# EasyEDA schematic lora_external_dev_board.json
TITLE: Sheet_1; REV: 1.0; Date: 2025-01-18; Sheet: 1/1; Drawn By: ruchika.3pvisionx; Company: Your Company
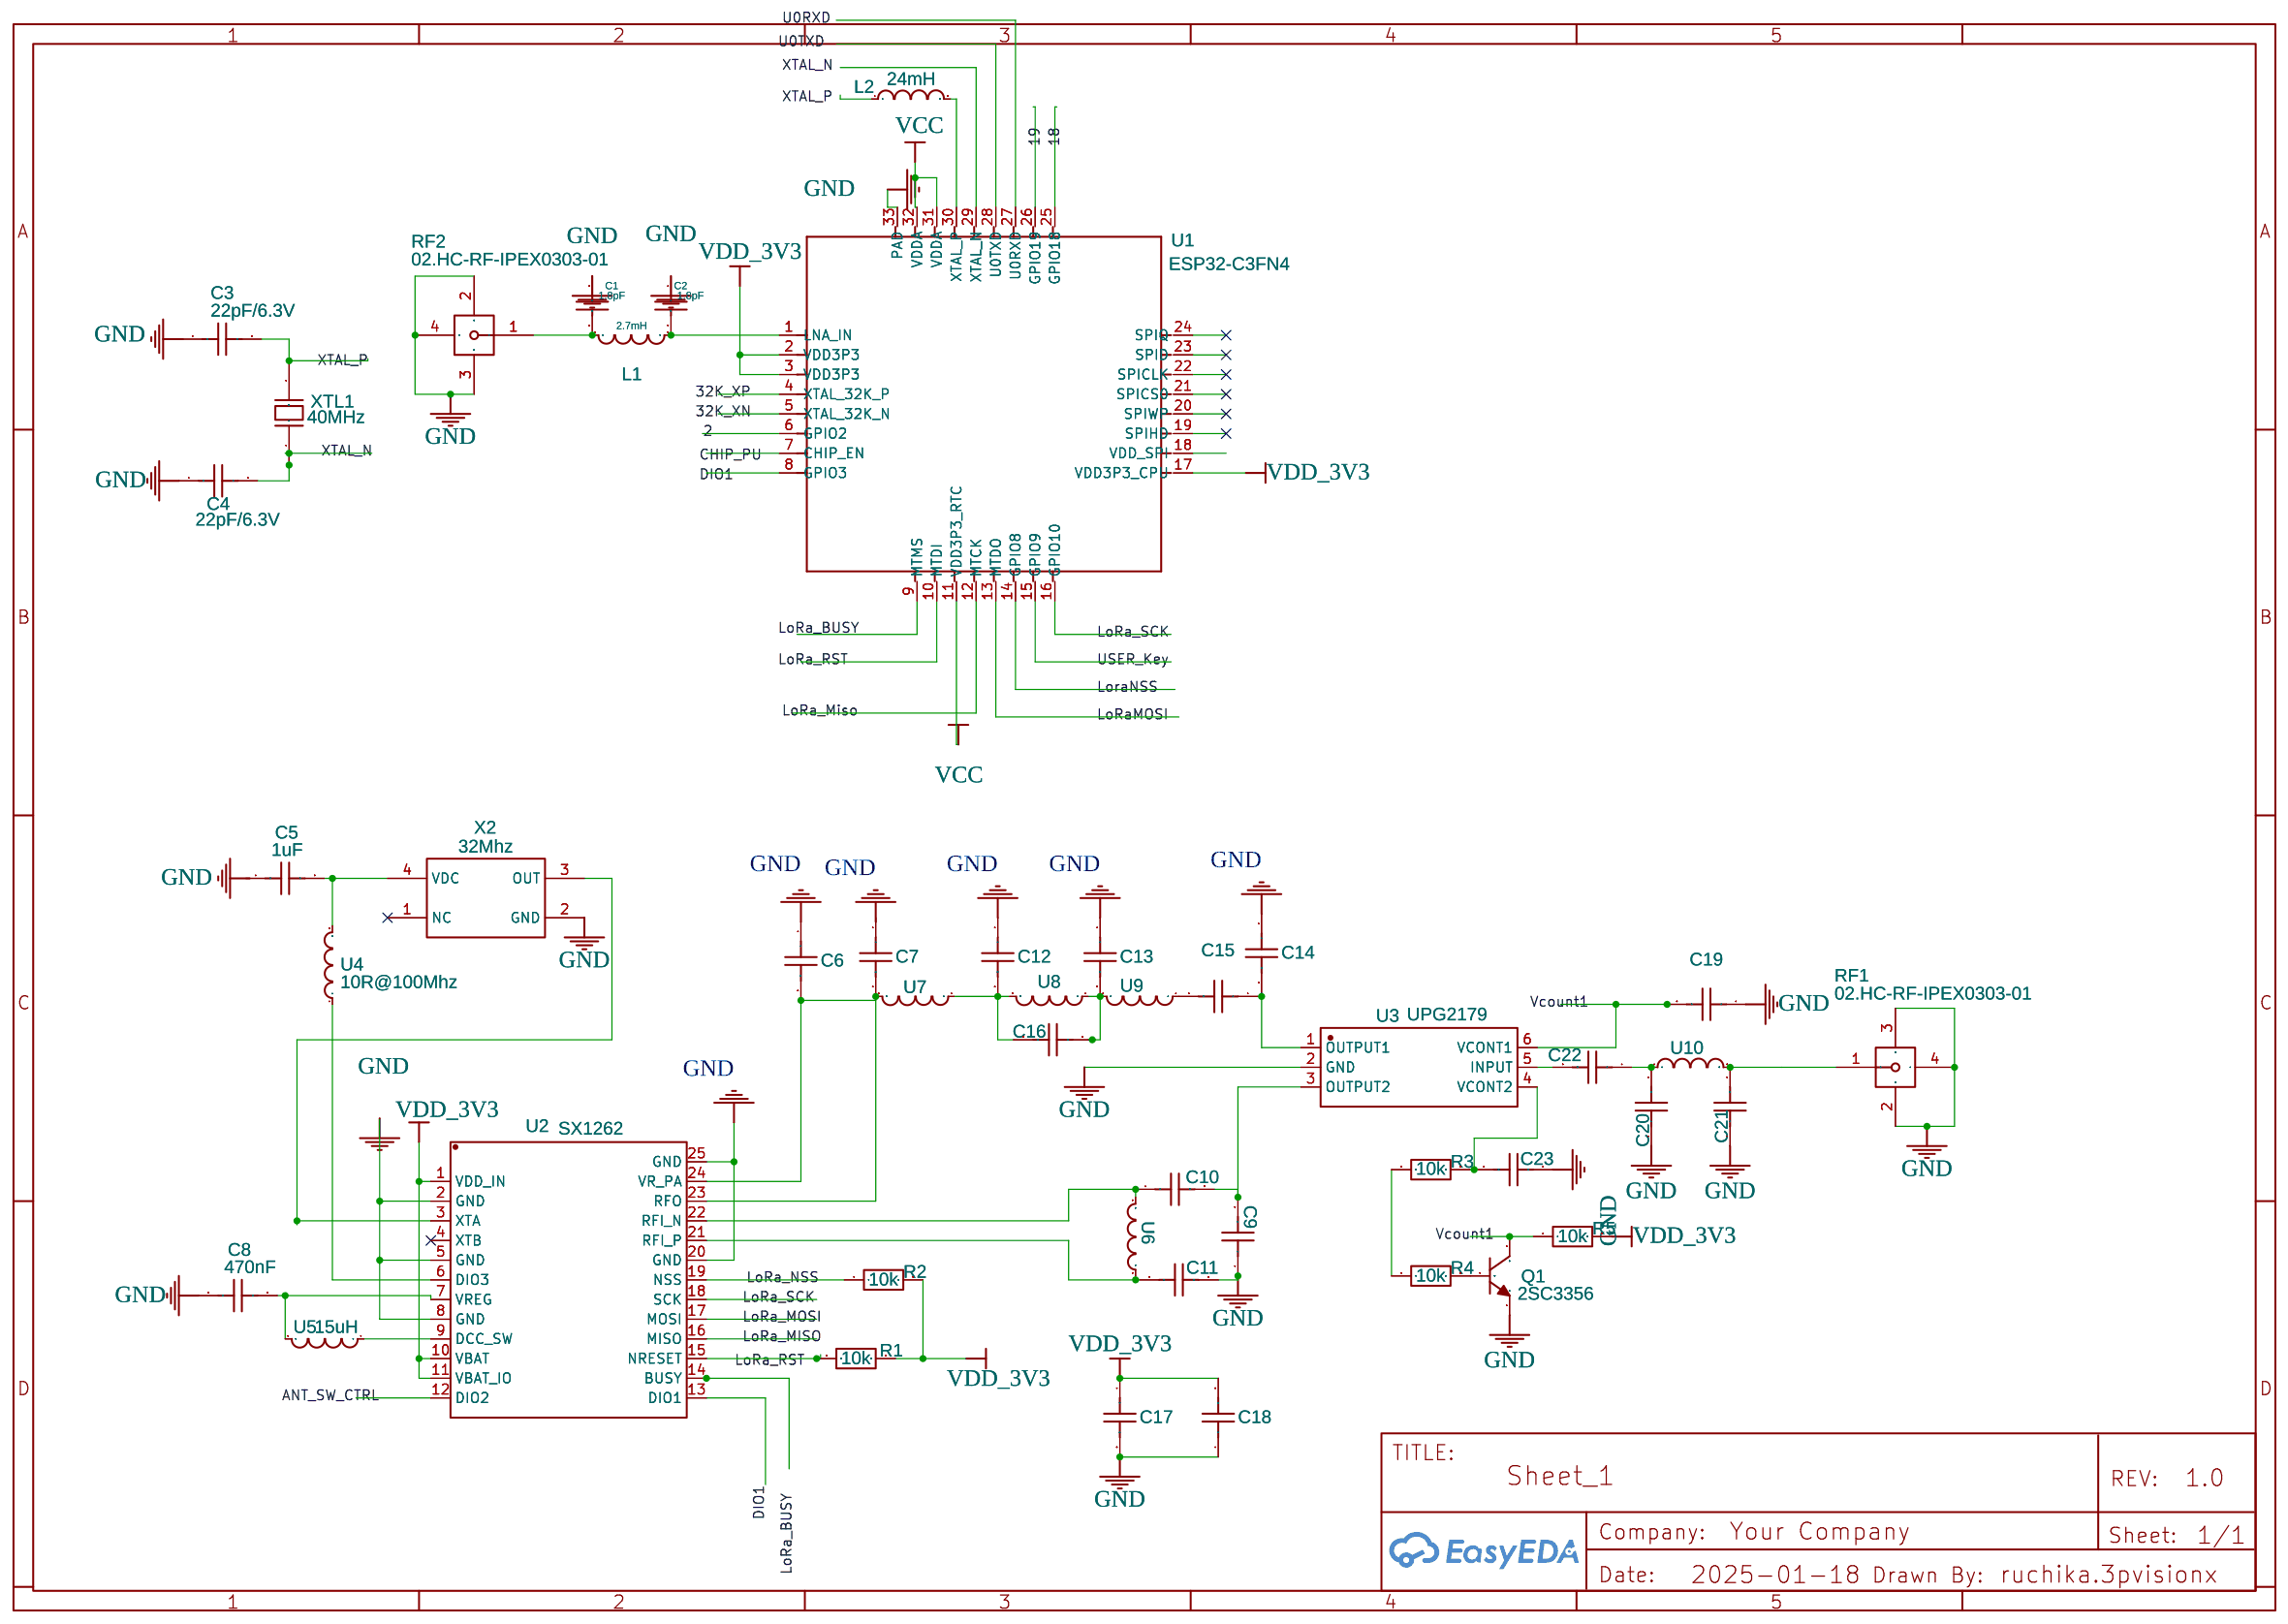
[diagram p0: schematic sheet]

## Parts
C1  1.8pF  [C0402]
C2  1.8pF  [C0402]
C3  22pF/6.3V  [C0402]
C4  22pF/6.3V  [C0402]
C5  1uF  [CAP-TH_L17.0-W8.5-P15.00-D1.2-FD]
C6  1uF  [CAP-TH_L17.0-W8.5-P15.00-D1.2-FD]
C7  1uF  [CAP-TH_L17.0-W8.5-P15.00-D1.2-FD]
C8  470nF  [CAP-TH_L17.0-W8.5-P15.00-D1.2-FD]
C9  1uF  [CAP-TH_L17.0-W8.5-P15.00-D1.2-FD]
C10  1uF  [CAP-TH_L17.0-W8.5-P15.00-D1.2-FD]
C11  1uF  [CAP-TH_L17.0-W8.5-P15.00-D1.2-FD]
C12  1uF  [CAP-TH_L17.0-W8.5-P15.00-D1.2-FD]
C13  1uF  [CAP-TH_L17.0-W8.5-P15.00-D1.2-FD]
C14  1uF  [CAP-TH_L17.0-W8.5-P15.00-D1.2-FD]
C15  1uF  [CAP-TH_L17.0-W8.5-P15.00-D1.2-FD]
C16  1uF  [CAP-TH_L17.0-W8.5-P15.00-D1.2-FD]
C17  1uF  [CAP-TH_L17.0-W8.5-P15.00-D1.2-FD]
C18  1uF  [CAP-TH_L17.0-W8.5-P15.00-D1.2-FD]
C19  1uF  [CAP-TH_L17.0-W8.5-P15.00-D1.2-FD]
C20  1uF  [CAP-TH_L17.0-W8.5-P15.00-D1.2-FD]
C21  1uF  [CAP-TH_L17.0-W8.5-P15.00-D1.2-FD]
C22  1uF  [CAP-TH_L17.0-W8.5-P15.00-D1.2-FD]
C23  1uF  [CAP-TH_L17.0-W8.5-P15.00-D1.2-FD]
L1  2.7mH  [2.7MH SB3M]
L2  24mH  [INDUCTOR]
Q1  2SC3356  [SOT-23-3_L2.9-W1.3-P1.90-LS2.4-BR-2]
R1  10k  [R0603]
R2  10k  [R0603]
R3  10k  [R0603]
R4  10k  [R0603]
R5  10k  [R0603]
RF1  02.HC-RF-IPEX0303-01  [IPEX-SMD_HC-RF-IPEX0303-01]
RF2  02.HC-RF-IPEX0303-01  [IPEX-SMD_HC-RF-IPEX0303-01]
U1  ESP32-C3FN4  [QFN32G-0.5-5X5MM]
U2  SX1262  [QFN-24_L4.0-W4.0-P0.50-BL-EP2.6]
U3  UPG2179  [SOT-363_L2.0-W1.3-P0.65-LS2.1-BL]
U4  10R@100Mhz  [IND-SMD_L1.6-W1.0]
U5  15uH  [IND-SMD_L1.6-W1.0]
U6  15uH  [IND-SMD_L1.6-W1.0]
U7  15uH  [IND-SMD_L1.6-W1.0]
U8  15uH  [IND-SMD_L1.6-W1.0]
U9  15uH  [IND-SMD_L1.6-W1.0]
U10  15uH  [IND-SMD_L1.6-W1.0]
X2  32Mhz  [40MHZ CRYSTAL OSCILLATOR]
XTL1  40MHz  [16MHZ CRYSTAL]

## Library data of the parts
C1 = GJM1555C1H1R8BB01D: Supplier: LCSC; Manufacturer: muRata(村田); Supplier Part: C76902; JLCPCB Part Class: Extended Part; Package Display: No
C2 = GJM1555C1H1R8BB01D: Supplier: LCSC; Manufacturer: muRata(村田); Supplier Part: C76902; JLCPCB Part Class: Extended Part
C3 C4 = 22PF/6.3V(10%)-0402: Contributor: LCSC; Supplier: LCSC; Supplier Part: C9900004403; Manufacturer: null; Manufacturer Part: 22pF/6.3V(10%)-0402; JLCPCB Part Class: Extended Part
C5-C23 = 1uf/250V/CBBCapacitor: Supplier Part: C29321; Supplier: LCSC; Manufacturer: ReliaPro; JLCPCB Part Class: Extended Part
L1 = 2.7mH sb3m: Contributor: hisound
L2 = Inductor TH: Manufacturer: ML; Supplier Part: C46030; LCSC Assembly: Yes; SMT Type: Extend; Paste Type: expand; Contributor: Blueblood
Q1 = 2SC3356_C5119709: Contributor: lcsc; Supplier: LCSC; Supplier Part: C5119709; Manufacturer: FOSAN(富信)
R1-R5 = 贴片电阻CHIPRESISTORS: Contributor: lcsc; Supplier: LCSC; Supplier Part: C9900014833; Manufacturer: null; Manufacturer Part: 贴片电阻ChipResistors; JLCPCB Part Class: Extended Part
RF1 RF2 = 02.HC-RF-IPEX0303-01: Contributor: LCSC; Supplier: LCSC; Supplier Part: C2894919; Manufacturer: HCTL(华灿天禄); Manufacturer Part: HC-RF-IPEX0303-01; JLCPCB Part Class: Extended Part
U1 = ESP32-C3FN4: Contributor: ruchika.3pvisionx
U2 = SX1262IMLTRT: Contributor: LCSC; Supplier: LCSC; Supplier Part: C191341; Manufacturer: SEMTECH; JLCPCB Part Class: Extended Part
U3 = UPG2179TB-E4-A: Contributor: lcsc; Supplier: LCSC; Supplier Part: C3312585; Manufacturer: RENESAS(瑞萨)/IDT; JLCPCB Part Class: Extended Part
U4-U10 = 10UH-INDUCTOR-0603: Contributor: lcsc; Supplier: LCSC; Supplier Part: C9900016650; Manufacturer: null; Manufacturer Part: 10uH-INDUCTOR-0603; JLCPCB Part Class: Extended Part
X2 = OSC40M-3.3/S5: Manufacturer: YIC; link: https://www.tme.eu/Document/456c7b2975a812de7905406dd4f750d9/YIC-S5.pdf; Contributor: rabirland
XTL1 = XTL - 16MHZ: Manufacturer Part: NTPL INSIDE; Contributor: athutony280402

## Nets
GND: C1.1 C2.1 C3.1 C4.1 C6.1 C8.1 C9.1 C11.2 C12.1 C13.1 C14.1 C17.2 C18.1 C19.1 C20.1 C21.1 C23.1 Q1.1(E) RF1.2 RF1.3 RF1.4 RF2.2 RF2.3 RF2.4 U1.33(PAD) U2.2(GND) U2.5(GND) U2.8(GND) U2.20(GND) U2.25(GND) U3.2(GND) X2.2(GND)
VCC: U1.11(VDD3P3_RTC) U1.31(VDDA) U1.32(VDDA)
VDD_3V3: C17.1 C18.2 R1.2 R2.2 R5.2 U1.2(VDD3P3) U1.3(VDD3P3) U1.17(VDD3P3_CPU) U2.1(VDD_IN) U2.10(VBAT) U2.11(VBAT_IO)
2: U1.6(GPIO2)
LoRa_MISO: U2.16(MISO)
LoRa_MOSI: U2.17(MOSI)
LoRa_NSS: R2.1 U2.19(NSS)
LoRa_SCK: U1.16(GPIO10) U2.18(SCK)
LoRaMOSI: U1.13(MTDO)
LoraNSS: U1.14(GPIO8)
USER_Key: U1.15(GPIO9)
XTAL_N: C4.2 XTL1.1
Net-(C1-2): C1.2 L1.1 RF2.1
Net-(C2-2): C2.2 L1.2 U1.1(LNA_IN)
Net-(C3-2): C3.2 XTL1.2
Net-(C5-2): C5.2 U4.2 X2.4(VDC)
Net-(C6-2): C6.2 C7.2 U2.23(RFO) U2.24(VR_PA) U7.2
Net-(C8-2): C8.2 U2.7(VREG) U5.2
Net-(C9-2): C9.2 C10.2 U3.3(OUTPUT2)
Net-(C10-1): C10.1 U2.22(RFI_N) U6.2
Net-(C11-1): C11.1 U2.21(RFI_P) U6.1
Net-(C12-2): C12.2 C16.2 U7.1 U8.2
Net-(C13-2): C13.2 C16.1 U8.1 U9.2
Net-(C14-2): C14.2 C15.1 U3.1(OUTPUT1)
Net-(C15-2): C15.2 U9.1
Net-(C19-2): C19.2 U3.6(VCONT1)
Net-(C20-2): C20.2 C22.1 U10.1
Net-(C21-2): C21.2 RF1.1 U10.2
Net-(C22-2): C22.2 U3.5(INPUT)
Net-(C23-2): C23.2 R3.2 U3.4(VCONT2)
Net-(L2-2): L2.2 U1.30(XTAL_P)
Net-(Q1-2): Q1.2(B) R4.2
Net-(Q1-3): Q1.3(C) R5.1
Net-(R1-1): R1.1 U2.15(NRESET)
Net-(R3-1): R3.1 R4.1
Net-(U2-3): U2.3(XTA) X2.3(OUT)
Net-(U2-6): U2.6(DIO3) U4.1
Net-(U2-9): U2.9(DCC_SW) U5.1

Not connected (* = marked no-connect by the designer): C5 1; C7 1; L2 1; U1 4(XTAL_32K_P) 5(XTAL_32K_N) 7(CHIP_EN) 8(GPIO3) 9(MTMS) 10(MTDI) 12(MTCK) 18(VDD_SPI) 19(SPIHD) 20(SPIWP) 21(SPICS0) 22(SPICLK) 23(SPID) 24(SPIQ) 25(GPIO18) 26(GPIO19) 27(U0RXD) 28(U0TXD) 29(XTAL_N); U2 4(XTB)* 12(DIO2) 13(DIO1) 14(BUSY); X2 1(NC)*
